# Altium schematic sheet [05]-Power.SchDoc
size A4
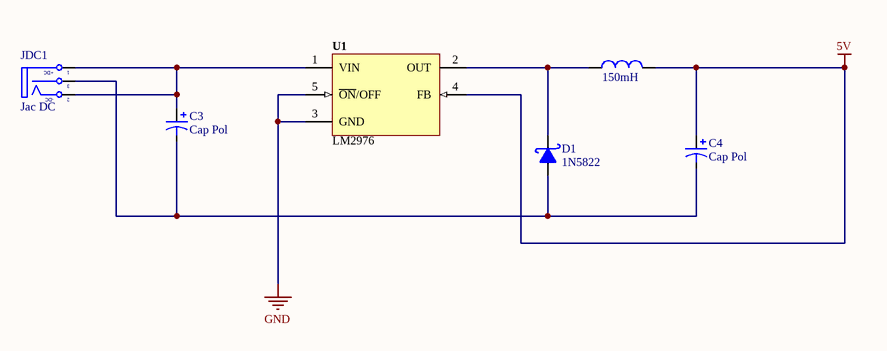
[diagram p0: [05]-Power.SchDoc]

## Parts
C3  Cap Pol  [C10mm]
C4  Cap Pol  [C10mm]
D1  1N5822  [SMA]
JDC1  Jac DC  [DC-IN]
L2  150mH  [L-SMD-M-7.3x4.5]
U1  LM2976  [TO-263]

## Nets
5V: C4.1 L2.2 U1.4(FB)
GND: U1.3(GND) U1.5(~{ON}/OFF)
NetC3_1: C3.1 JDC1.1(T) JDC1.2(TN) U1.1(VIN)
NetC3_2: C3.2 C4.2 D1.1(A) JDC1.3(S)
NetD1_2: D1.2(K) L2.1 U1.2(OUT)

## Notes on the sheet
- (in symbol DCIN) +DC; -DC

## Library data of the parts
C3 C4 = Cap Pol: Polarized Capacitor (Axial); Published: 8-Jun-2000; LatestRevisionDate: 17-Jul-2002; LatestRevisionNote: Re-released for DXP Platform.; PackageReference: POLAR0.8; Publisher: Altium Limited
D1 = 1N5822: Schottky Rectifiers; Value: Diode c?m 1N5408
JDC1 = DCIN: Jac DC input; Value: Jac DC
L2 = Inductor: Value: 150 mH
U1 = LM2596: Max Input Voltage: 12 V; Max Output Current: 3 (6.0 peak) A; Max Output Voltage: mV; Category: IC-Power; Min Input Voltage: mV; Min Output Voltage: mV; Mounting Technology: Surface Mount; Status: Unreleased; Supply Voltage: mV; Temperature Range: -40 to +125 degC